# EAGLE design PiSmoker_pwr_triac_isol (EAGLE 7.6.0)
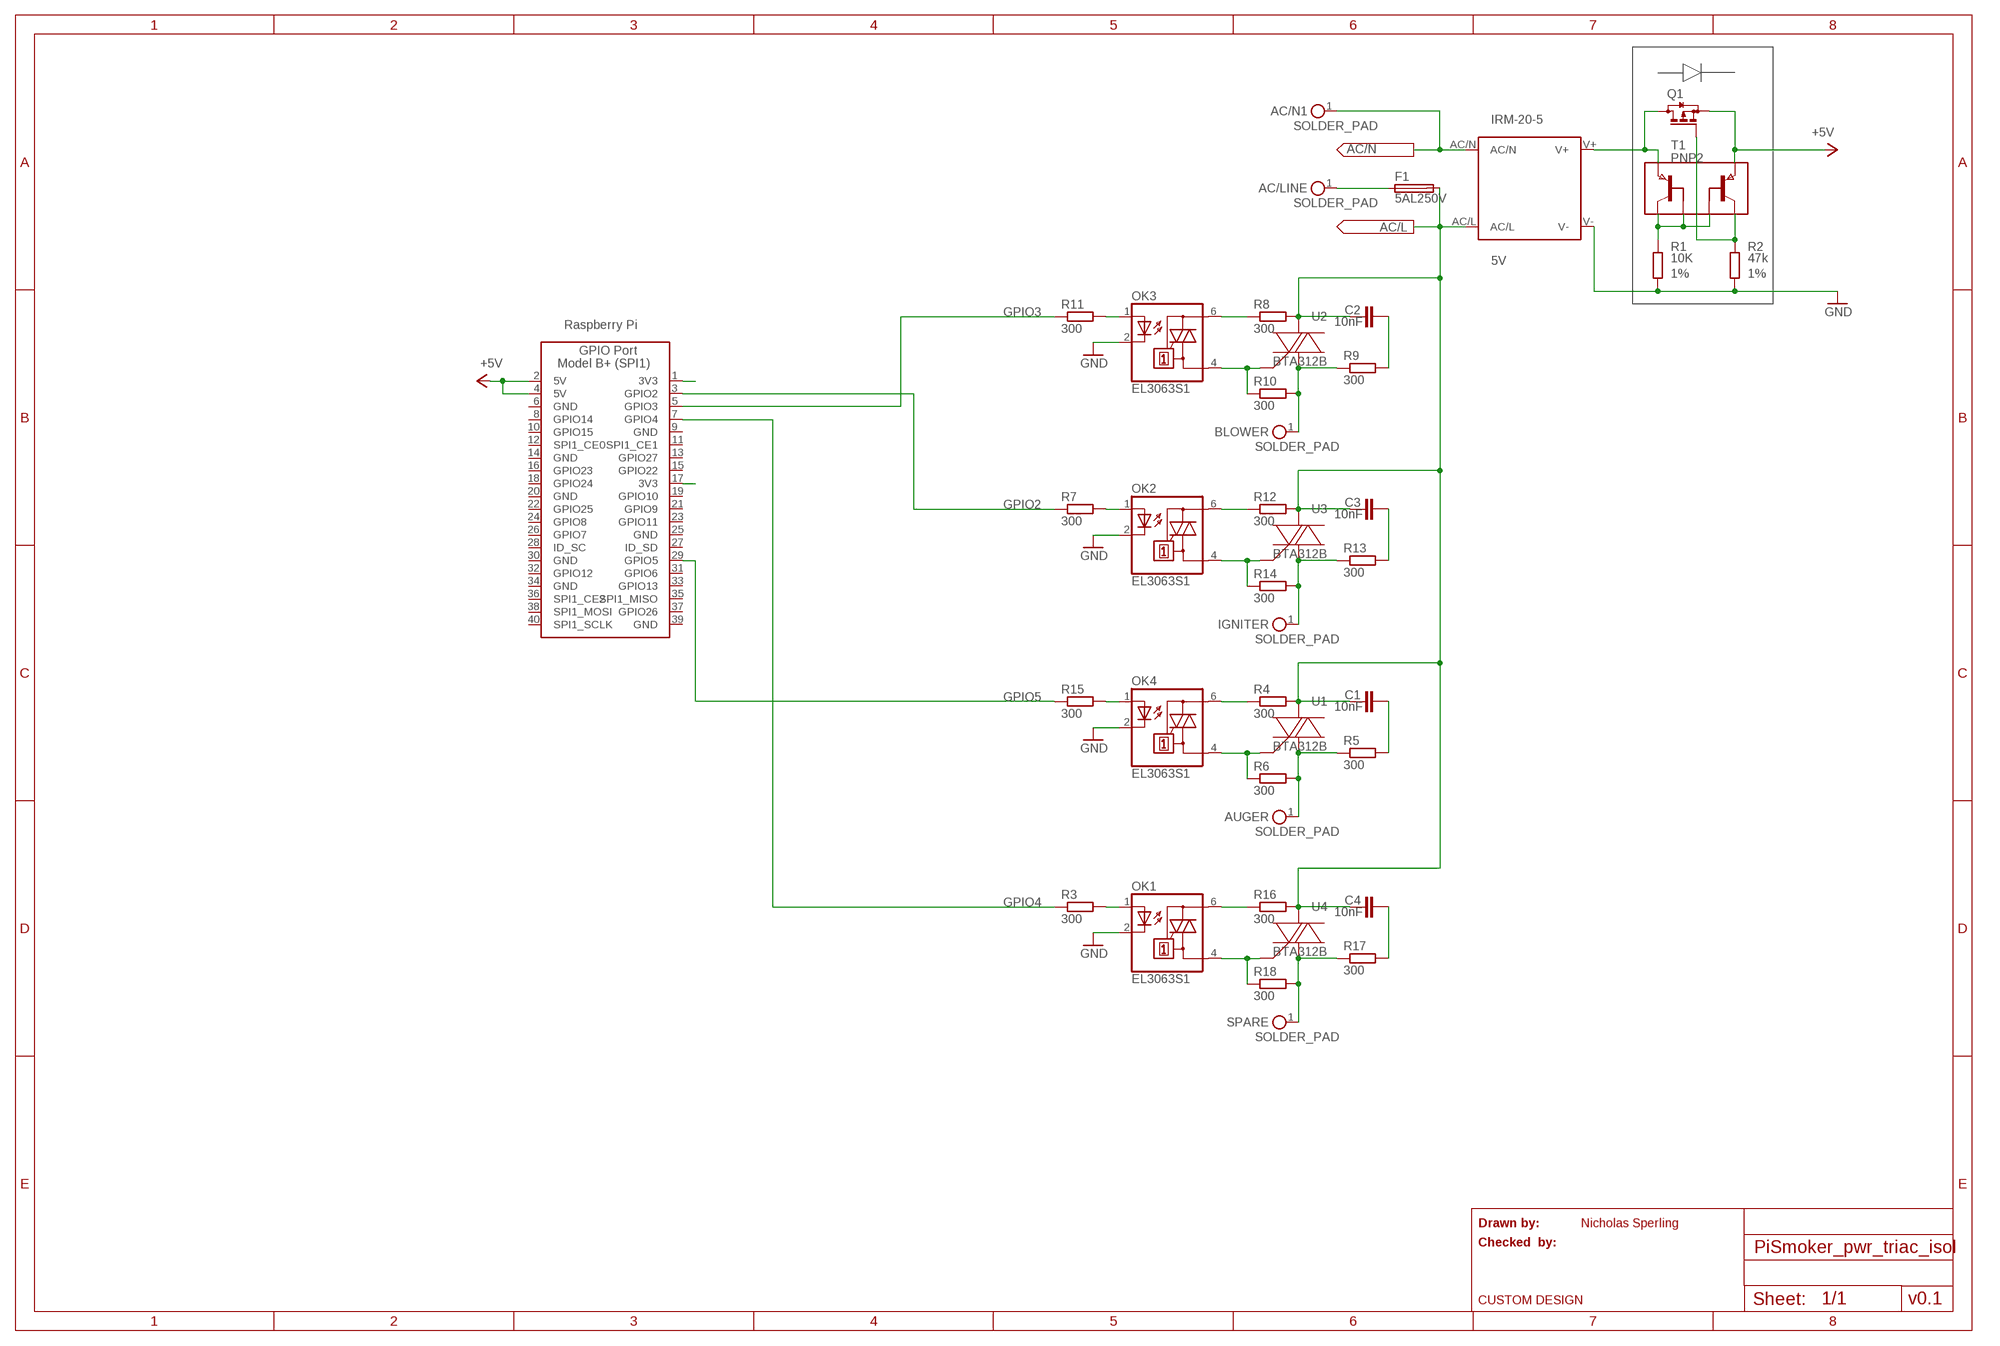
[diagram p0: schematic, sheet 1]

## Parts
AC/LINE  SOLDER_PAD  [SOLDER_PAD_18AWG]
AC/N1  SOLDER_PAD  [SOLDER_PAD_18AWG]
AUGER  SOLDER_PAD  [SOLDER_PAD_18AWG]
BLOWER  SOLDER_PAD  [SOLDER_PAD_18AWG]
C1  10nF  C-EUC1206  [C1206]
C2  10nF  C-EUC1206  [C1206]
C3  10nF  C-EUC1206  [C1206]
C4  10nF  C-EUC1206  [C1206]
F1  5AL250V  OGN_FUSE  [OGN_SMD]
IGNITER  SOLDER_PAD  [SOLDER_PAD_18AWG]
IRM-20-5  5V  IRM_15/20  [IRM_15/20]
OK1  EL3063S1  [SMD6]
OK2  EL3063S1  [SMD6]
OK3  EL3063S1  [SMD6]
OK4  EL3063S1  [SMD6]
Q1  BSS84  [SOT23]
R1  10K  R-EU_M0805  [M0805]
R2  47k  R-EU_M0805  [M0805]
R3  300  R-EU_M0805  [M0805]
R4  300  R-EU_M0805  [M0805]
R5  300  R-EU_M0805  [M0805]
R6  300  R-EU_M0805  [M0805]
R7  300  R-EU_M0805  [M0805]
R8  300  R-EU_M0805  [M0805]
R9  300  R-EU_M0805  [M0805]
R10  300  R-EU_M0805  [M0805]
R11  300  R-EU_M0805  [M0805]
R12  300  R-EU_M0805  [M0805]
R13  300  R-EU_M0805  [M0805]
R14  300  R-EU_M0805  [M0805]
R15  300  R-EU_M0805  [M0805]
R16  300  R-EU_M0805  [M0805]
R17  300  R-EU_M0805  [M0805]
R18  300  R-EU_M0805  [M0805]
SPARE  SOLDER_PAD  [SOLDER_PAD_18AWG]
T1  PNP2  [SOT26]
U1  BTA312B  [D2PAK-3]
U2  BTA312B  [D2PAK-3]
U3  BTA312B  [D2PAK-3]
U4  BTA312B  [D2PAK-3]
X1  RASPI_GPIO_3B_SPI1_M20-781_SMD_LOWER_NOHOLES  [M20-781_SMD_LOWER_NOHOLES]

## Nets
+5V [PWR]: Q1.2(S) T1.5(E2) X1.2(5V) X1.4(5V)
AC/L [PWR]: C1.1 C2.1 C3.1 C4.1 F1.2 IRM-20-5.AC/L R4.2 R8.2 R12.2 R16.2 U1.MB(MT2) U2.MB(MT2) U3.MB(MT2) U4.MB(MT2)
AC/N [PWR]: AC/N1.1(SK) IRM-20-5.AC/N
AUGER_AC/L [PWR]: AUGER.1(SK) R5.1 R6.2 U1.1(MT1)
BLOWER_AC/L [PWR]: BLOWER.1(SK) R9.1 R10.2 U2.1(MT1)
GND [PWR]: IRM-20-5.V- OK1.2(C) OK2.2(C) OK3.2(C) OK4.2(C) R1.1 R2.1
GPIO2 [PWR]: R7.1 X1.3(GPIO2)
GPIO3 [PWR]: R11.1 X1.5(GPIO3)
GPIO4 [PWR]: R3.1 X1.7(GPIO4)
GPIO5 [PWR]: R15.1 X1.29(GPIO5)
IGNITER_AC/L [PWR]: IGNITER.1(SK) R13.1 R14.2 U3.1(MT1)
N$1 [PWR]: C1.2 R5.2
N$2 [PWR]: OK1.1(A) R3.2
N$3 [PWR]: C2.2 R9.2
N$4 [PWR]: OK3.6(A2) R8.1
N$5 [PWR]: OK3.4(A1) R10.1 U2.3(G)
N$6 [PWR]: OK2.1(A) R7.2
N$7 [PWR]: OK2.4(A1) R14.1 U3.3(G)
N$8 [PWR]: OK2.6(A2) R12.1
N$9 [PWR]: C3.2 R13.2
N$10 [PWR]: OK3.1(A) R11.2
N$11 [PWR]: OK4.6(A2) R4.1
N$12 [PWR]: IRM-20-5.V+ Q1.3(D) T1.6(E1)
N$13: Q1.1(G) R2.2 T1.4(C2)
N$14: R1.2 T1.1(C1) T1.2(B1) T1.3(B2)
N$15 [PWR]: OK4.4(A1) R6.1 U1.3(G)
N$16 [PWR]: C4.2 R17.2
N$17 [PWR]: OK4.1(A) R15.2
N$18 [PWR]: OK1.4(A1) R18.1 U4.3(G)
N$19 [PWR]: OK1.6(A2) R16.1
N$20 [PWR]: AC/LINE.1(SK) F1.1
N$21 [PWR]: X1.1(3V3)
N$22 [PWR]: X1.17(3V3)
SPARE_AC/L [PWR]: R17.1 R18.2 SPARE.1(SK) U4.1(MT1)
Unconnected: X1.8(GPIO14) X1.10(GPIO15) X1.11(SPI1_CE1) X1.12(SPI1_CE0) X1.13(GPIO27) X1.15(GPIO22) X1.16(GPIO23) X1.18(GPIO24) X1.19(GPIO10) X1.21(GPIO9) X1.22(GPIO25) X1.23(GPIO11) X1.24(GPIO8) X1.26(GPIO7) X1.27(ID_SD) X1.28(ID_SC) X1.31(GPIO6) X1.32(GPIO12) X1.33(GPIO13) X1.35(SPI1_MISO) X1.36(SPI1_CE2) X1.37(GPIO26) X1.38(SPI1_MOSI) X1.40(SPI1_SCLK)

## Notes on the sheet
- Drawn by: | Nicholas Sperling
- Checked  by:
- CUSTOM DESIGN | v0.1

## Power pins joined to a net without a drawn wire
GND: X1.6(GND) X1.9(GND) X1.14(GND) X1.20(GND) X1.25(GND) X1.30(GND) X1.34(GND) X1.39(GND)

## Library data of the parts
AC/LINE AC/N1 AUGER BLOWER IGNITER SPARE = Custom:SOLDER_PAD
C1-C4 = resistor:C-EU: CAPACITOR, European symbol
F1 = Custom:OGN_FUSE: FUSE HOLDER grid 22,5 mm, OGN0031 8201, Schurter (Buerklin); MF: SCHURTER; MPN: 0031.8201; OC_FARNELL: 1162740; OC_NEWARK: 96F8317
IRM-20-5 = Custom:IRM_15/20: 15 or 20 watt housing & pin compatible IRM 15 Vout [V] Imax [A] Pmax [W] Eff [%] 3.3 3.5 11.55 74 5 3 15 78 12 1.25 15 82 15 1 15 82 24 0.63 15.12 83 IRM 20 Vout [V] Imax [A] Pmax [W] Eff [%] 3.3 4.5 14.85 76 5 4 20 79 12 1.8 21.6 84 15 1.4 21.6 84 24 0.9 21.6 85
OK1-OK4 = Custom:EL30*: 6-Pin DIP Zero-Cross Optoisolators Triac Driver Output (250/400 Volt Peak) Source: Data sheet <http://www.fairchildsemi.com/ds/MO/MOC3031M.pdf> The old path of data sheet not more available 2013-05-06.
Q1 = transistor-small-signal:BSS84: P-CHANNEL MOS FET
R1 R2 = resistor:R-EU_: RESISTOR, European symbol; TOLERANCE: 1%
R3-R18 = resistor:R-EU_: RESISTOR, European symbol; TOLERANCE: 5%
T1 = Custom:PNP2: Dual PNP TRANSISTOR
U1-U4 = Custom:BTA312B
X1 = Custom:RASPI_GPIO_3B_SPI1: 2x20 header connector, all pins connected

## Net classes
1 PWR: width 0.406 mm

## Board
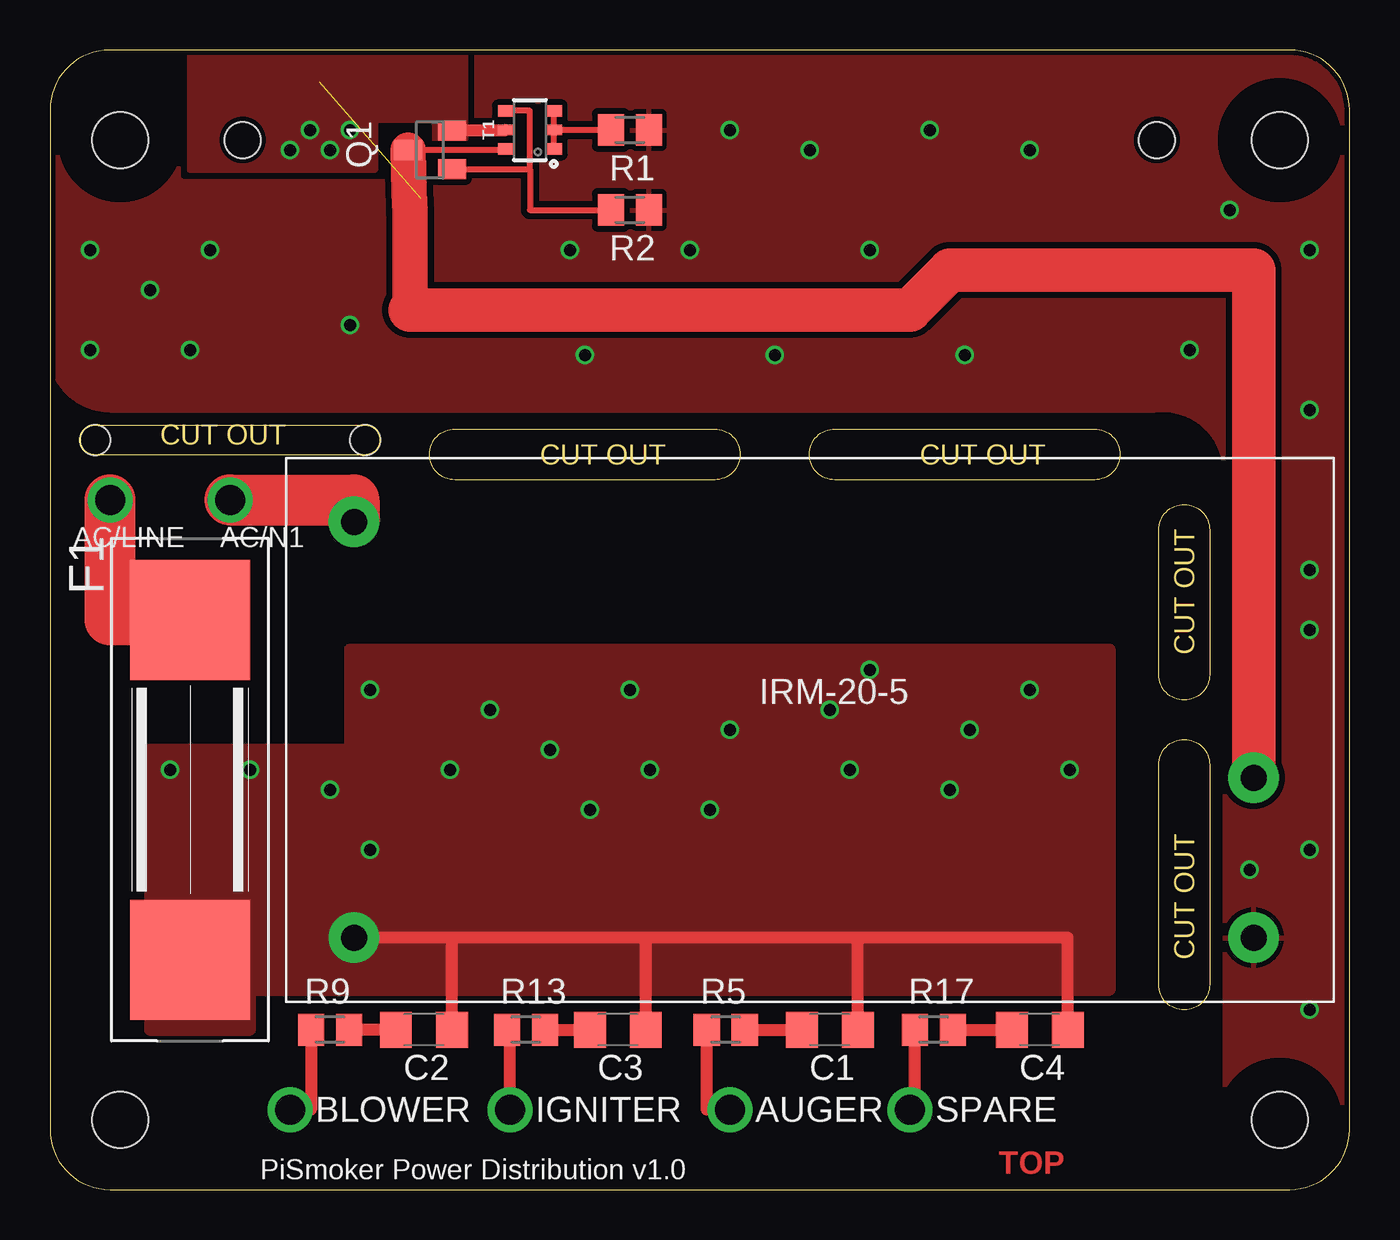
[diagram p1: board, top side]
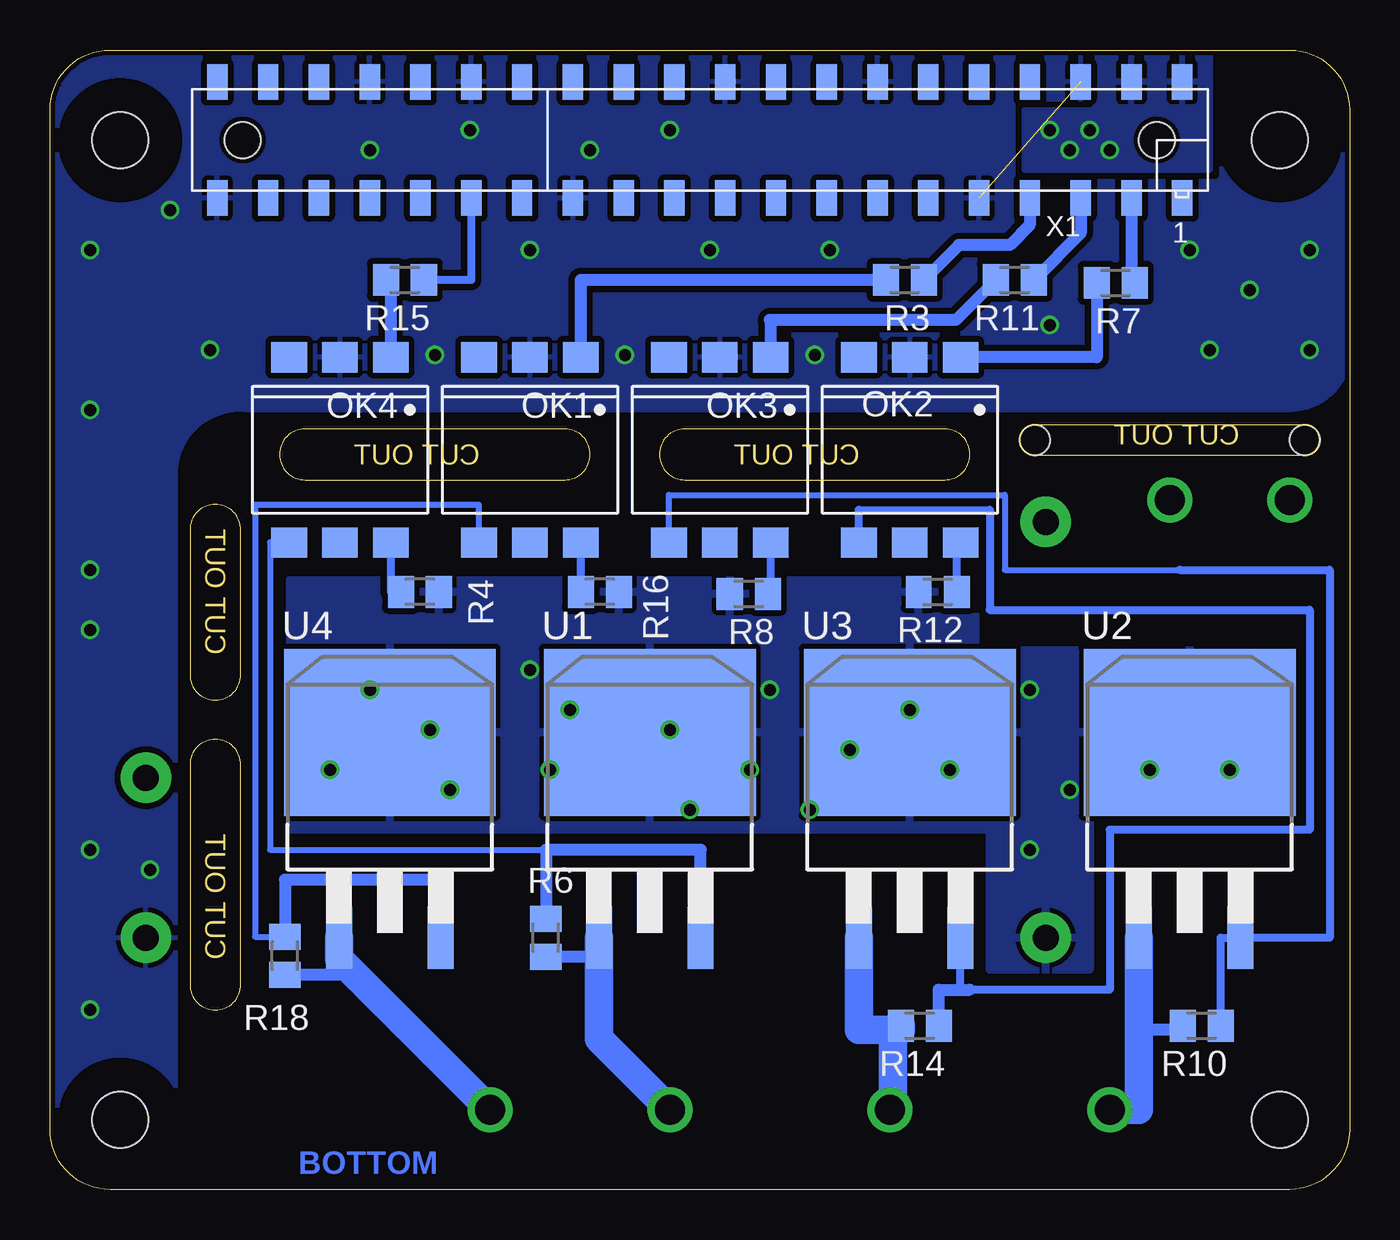
[diagram p2: board, bottom side, seen from below]

Size 65 x 57 mm. Coordinates in mm from the lower left corner, seen from the top.
Outline: 0,3 arc90 3,0 62,0 arc90 65,3 65,54 arc90 62,57 3,57 arc90 0,54 0,3
Outline: 20.25,38.04 33.25,38.04 arc-180 33.25,35.5 20.25,35.5 arc-180 20.25,38.04
Outline: 2.25,38.25 15.75,38.25 arc-180 15.75,36.75 2.25,36.75 arc-180 2.25,38.25
Outline: 39.25,38.04 52.25,38.04 arc-180 52.25,35.5 39.25,35.5 arc-180 39.25,38.04
Outline: 55.46,25.75 55.46,33 arc-180 58,33 58,25.75 arc-180 55.46,25.75
Outline: 55.46,10.25 55.46,21.25 arc-180 58,21.25 58,10.25 arc-180 55.46,10.25
Copper layers (1*16): Top 0.035mm / dielectric 1.5mm / Bottom 0.035mm
Design rules "ITEADstudio_DRC *": minimum track width 6mil, minimum drill 12mil, track to track 12mil, track to pad 12mil, pad to pad 12mil, via to via 12mil, smd to smd 0mil, copper to edge 10mil, drill to drill 10mil, minimum pad ring 10mil, minimum via ring 6mil, stop-mask expansion 2mil, vias tented up to drill 100mil, thermal gap 10mil
Holes 2.8 mm at 3.5,3.5 3.5,52.5 61.5,52.5 61.5,3.5
Holes 1.5 mm at 2.25,37.5 15.75,37.5
tRestrict: area 1.9,51 to 5,54; area 60,51 to 63,54; area 60,1.9 to 63,5; area 1.9,1.9 to 5,5
bRestrict: area 1.9,1.9 to 5,5; area 1.9,51 to 5,54; area 60,1.9 to 63,5; area 60,51 to 63,54

### Footprints (pad centres in the part's own frame; a part is rotated, then mirrored left to right if it is on the bottom)
SOLDER_PAD_18AWG = drill 1.5: 1 0,0
C1206 = smd 1.6 x 1.8: 1 -1.4,0; 2 1.4,0
OGN_SMD = smd 6 x 6: 1 -8.5,0; 2 8.5,0
IRM_15/20 = drill 1.3 pad 2.54: AC/L -22.8,-10.4; AC/N -22.8,10.4; V+ 22.2,-2.4; V- 22.2,-10.4
SMD6 = smd 1.78 x 1.52: 1 -2.54,-4.635; 2 0,-4.635; 3 2.54,-4.635; 4 2.54,4.635; 5 0,4.635; 6 -2.54,4.635
SOT23 = smd 1 x 1.4: 1 -0.95,-1.1; 2 0.95,-1.1; 3 0,1.1
M0805 = smd 1.3 x 1.6: 1 -0.95,0; 2 0.95,0
SOT26 = smd 0.55 x 0.8: 1 -0.95,-1.2; 2 0,-1.2; 3 0.95,-1.2; 4 0.95,1.2; 5 0,1.2; 6 -0.95,1.2
D2PAK-3 = smd 1.3 x 3.1: 1 -2.54,-6.4; 3 2.54,-6.4 | smd 10.6 x 8.35: MB 0,3.875
M20-781_SMD_LOWER_NOHOLES = smd 1.02 x 1.78 bottom: 1 -24.13,-2.91; 2 -24.13,2.91; 3 -21.59,-2.91; 4 -21.59,2.91; 5 -19.05,-2.91; 6 -19.05,2.91; 7 -16.51,-2.91; 8 -16.51,2.91; 9 -13.97,-2.91; 10 -13.97,2.91; 11 -11.43,-2.91; 12 -11.43,2.91; 13 -8.89,-2.91; 14 -8.89,2.91; 15 -6.35,-2.91; 16 -6.35,2.91; 17 -3.81,-2.91; 18 -3.81,2.91; 19 -1.27,-2.91; 20 -1.27,2.91; 21 1.27,-2.91; 22 1.27,2.91; 23 3.81,-2.91; 24 3.81,2.91; 25 6.35,-2.91; 26 6.35,2.91; 27 8.89,-2.91; 28 8.89,2.91; 29 11.43,-2.91; 30 11.43,2.91; 31 13.97,-2.91; 32 13.97,2.91; 33 16.51,-2.91; 34 16.51,2.91; 35 19.05,-2.91; 36 19.05,2.91; 37 21.59,-2.91; 38 21.59,2.91; 39 24.13,-2.91; 40 24.13,2.91 | hole 1.8: -22.86,0; 22.86,0

### Placement (x,y rotation side)
AC/LINE  3,34.5 90 top
AC/N1  9,34.5 90 top
AUGER  34,4 0 top
BLOWER  12,4 0 top
C1  39,8 180 top
C2  18.7,8 180 top
C3  28.4,8 180 top
C4  49.5,8 180 top
F1  7,20 270 top
IGNITER  23,4 0 top
IRM-20-5  38,23 0 top
OK1  41,37 180 bottom
OK2  22,37 180 bottom
OK3  31.5,37 180 bottom
OK4  50.5,37 180 bottom
Q1  19,52 90 top
R1  29,53 180 top
R2  29,49 180 top
R3  22.25,45.5 180 bottom
R4  46.5,29.9 0 bottom
R5  33.8,8 0 top
R6  40.2,12.6 270 bottom
R7  11.7,45.35 180 bottom
R8  30.05,29.8 180 bottom
R9  14,8 0 top
R10  7.4,8.2 180 bottom
R11  16.75,45.5 180 bottom
R12  20.6,29.9 180 bottom
R13  23.8,8 0 top
R14  21.5,8.2 180 bottom
R15  47.25,45.5 180 bottom
R16  37.5,29.9 0 bottom
R17  44.2,8 0 top
R18  53.25,11.7 270 bottom
SPARE  43,4 0 top
T1  24,53 90 top
U1  35,19 0 bottom
U2  8,19 0 bottom
U3  22,19 0 bottom
U4  48,19 0 bottom
X1  32.5,52.5 0 top

### Tracks (layer width: path | path; a pad name or v marks a point on that pad's centre or on a via)
+5V  (via drill 0.6)
  Top 0.61: Q1.2 20.15,53 T1.5
  other vias: 15,53 13,53 14,52 12,52
  pour Top (no thermals): 20.75,52.5 19.25,52.5 19.25,53.5 16.25,53.5 16.25,51 7,51 7,57 20.75,57
  pour Bottom: 7,57 7,51 16.25,51 16.25,54 12.75,54 12.75,57
AC/L  (via drill 0.6)
  Top 0.61: C2.1 20.1,12.6 IRM-20-5.AC/L | C3.1 29.8,12.6 IRM-20-5.AC/L | C1.1 40.4,12.6 IRM-20-5.AC/L | C4.1 50.9,12.6 IRM-20-5.AC/L
  other vias: 6,21 10,21 14,20 16,17 20,21 27,19 30,21 33,19 40,21 45,20 51,21 16,25 22,24 29,25 34,23 41,26 39,24 49,25 46,23 25,22
  pour Bottom: 3,27 3,19 13,19 13,11 18,11 18,18 53,18 53,30.5 18.75,30.5 18.75,27
  pour Top (no thermals): 5,22 5,8 10,8 10,10 53,10 53,27 15,27 15,22
AC/N
  Top 2.54: AC/N1.1 15.2,34.5 IRM-20-5.AC/N
AUGER_AC/L
  Top 0.61: AUGER.1 32.85,4 R5.1
  Bottom 0.61: U1.1 37.54,11.65 R6.2
  Bottom 1.422: U1.1 37.54,7.54 AUGER.1
BLOWER_AC/L
  Top 0.61: R9.1 13.05,4 BLOWER.1
  Bottom 0.61: R10.2 8.35,8 10.54,8
  Bottom 1.422: U2.1 10.54,8 10.54,4 BLOWER.1
GND  (via drill 0.6)  (1 unrouted)
  other vias: 2,47 5,45 2,42 7,42 8,47 34,53 38,52 41,47 49,52 44,53 63,47 57,42 15,43.25 63,39 63,31 63,28 63,17 60,16 63,9 59,49 26.75,41.75 36.25,41.75 45.75,41.75 32,47 26,47
  pour Bottom (rank 6): 0,54 0,42 arc90 3,39 55.25,39 arc-90 58.75,36 58.75,3 arc90 61.25,0 62,0 arc90 65,3 65,54 arc90 62,57 3,57 arc90
  pour Top (rank 6): 0,54 0,42 arc90 3,39 55.25,39 arc-90 58.75,36.25 58.75,3.25 arc90 61.25,0 62,0 arc90 65,3 65,54 arc90 62,57 3,57 arc90
GPIO2
  Bottom 0.61: X1.3 10.91,45.35 R7.1
GPIO3
  Bottom 0.61: X1.5 13.45,47.85 R11.1
GPIO4
  Bottom 0.61: X1.7 15.99,48.26 17,47.25 19.55,47.25 R3.1
GPIO5
  Bottom 0.406: X1.29 43.93,45.5 R15.1
IGNITER_AC/L
  Top 0.61: IGNITER.1 23,7.85 R13.1
  Bottom 1.422: U3.1 24.54,8 R13.1 | R13.1 22.85,4 IGNITER.1 | R14.2 22.45,8 R13.1
N$1
  Top 0.61: R5.2 C1.2
N$2
  Bottom 0.61: R3.2 38.46,45.5 OK1.1
N$3
  Top 0.61: C2.2 R9.2
N$4
  Bottom 0.406: OK3.6 28.96,29.8 R8.1
N$5
  Bottom 0.305: OK3.4 34.04,34.75 17.25,34.75 17.25,31 8.5,31
  Bottom 0.406: 8.5,31 1,31 1,12.6 U2.3 6.45,12.6 R10.1
N$6
  Bottom 0.61: R7.2 12.65,41.63 OK2.1
N$7
  Bottom 0.406: U3.3 19.46,10 19,10 12,10 12,18 2,18 2,29 18,29 18,34 24.54,34 OK2.4
  Bottom 0.61: R14.1 20.55,10 19,10
N$8
  Bottom 0.406: R12.1 19.65,32.37 OK2.6
N$9
  Top 0.61: R13.2 C3.2
N$10
  Bottom 0.61: R11.2 19.7,43.5 29,43.5 28.96,43.46 OK3.1
N$11
  Bottom 0.406: OK4.6 47.96,29.9 R4.1
N$12
  Top 0.305: T1.6 22.8,52 Q1.3
  Top 1.778: Q1.3 arc0 18,48.85 18,44
  Top 2.184: IRM-20-5.V+ 60.2,46 45,46 43,44 18,44
N$13
  Top 0.305: Q1.1 24,51.05 | 24,51.05 24,53.95 T1.4 | 24,51.05 24,49 R2.2
N$14
  Top 0.305: T1.1 T1.2 | T1.2 T1.3 | R1.2 T1.2
N$15
  Bottom 0.305: OK4.4 54,32.37 54,17 40.2,17
  Bottom 0.61: R6.1 40.2,17 32.46,17 U1.3
N$16
  Top 0.61: R17.2 C4.2
N$17
  Bottom 0.61: R15.2 47.96,45.5 OK4.1
N$18
  Bottom 0.305: OK1.4 43.54,34.25 54.75,34.25 54.75,12.65 R18.1
  Bottom 0.61: U4.3 45.46,15.5 53.25,15.5 R18.1
N$19
  Bottom 0.406: OK1.6 R16.1
N$20
  Top 2.54: F1.1 3,28.5 AC/LINE.1
SPARE_AC/L
  Top 0.61: SPARE.1 43.25,4 R17.1
  Bottom 0.61: U4.1 50.54,10.75 R18.2
  Bottom 1.422: U4.1 50.54,11.54 SPARE.1

### Text on the board
Top: TOP
Bottom: BOTTOM
Dimension: CUT OUT | CUT OUT | CUT OUT | CUT OUT | CUT OUT
tPlace: PiSmoker Power Distribution v1.0